# Altium schematic sheet GPS.SchDoc
size A4; SheetNumber: 6; SheetTotal: 8
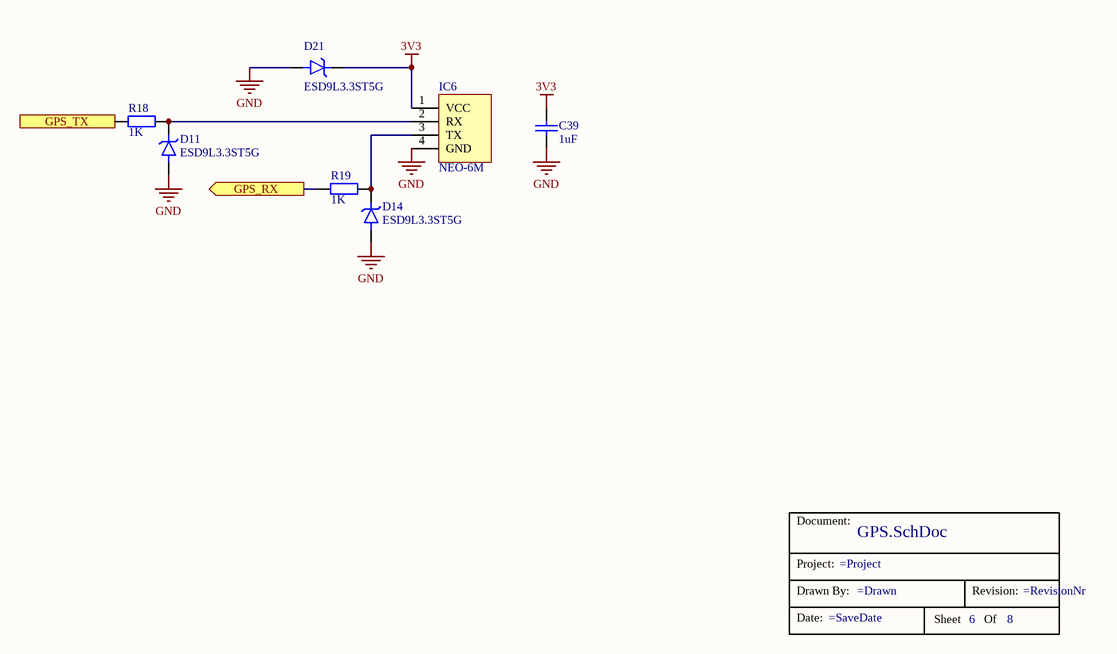
[diagram p0: GPS.SchDoc]

## Parts
*  TitleBox  (value not drawn)
C39  Capacitance: 1uF  [C0603 N]
D11  ESD9L3.3ST5G  [SOD923F, NOMINAL]
D14  ESD9L3.3ST5G  [SOD923F, NOMINAL]
D21  ESD9L3.3ST5G  [SOD923F, NOMINAL]
IC6  NEO-6M  [NEO-6M Module]
R18  1K  [R0603]
R19  1K  [R0603]

## Ports
GPS_RX (out), GPS_TX (in)

## Nets
3V3: C39.2 D21.C IC6.1(VCC)
GND: C39.1 D11.A D14.A D21.A IC6.4(GND)
GPS_RX: R19.2 ; port GPS_RX
GPS_TX: R18.2 ; port GPS_TX
NetD11_C: D11.C IC6.2(RX) R18.1
NetD14_C: D14.C IC6.3(TX) R19.1

## Notes on the sheet
- (in symbol TitleBox) Document:; Project:; Drawn By:; Revision:; Date:; Sheet; Of

## Library data of the parts
C39 = Capacitor: Ceramic capacitor; Type: MLCC; Voltage rating: *V; Characteristic: *; Manufacturer: *; Note: C0603 N
D11 D14 D21 = ESD9L3.3ST5G: TVS DIODE, Unidir, 3.3V/9V, 150mW, SOD-923, ESD9L3.3ST5G, ON SEMICONDUCTOR; Clamping Voltage: 9V; Reverse Standoff Voltage: 3.3V; Breakdown Voltage: 4.8V; Peak Pulse Current: 1A; Leakage Current: 1uA; Supplier 1: Farnell; Manufacturer: ON Semiconductor; Manufacturer Part Number: ESD9L3.3ST5G; Case/Package: SOD-923-2; Operating Temperature Range: -55 .. 125°C; Peak Pulse Power: 150mW; ComponentLink1URL: https://www.verical.com/server-webapp/html/getDatasheet?partID=148186&src-supplier=Verical; ComponentLink1Description: Datasheet; Supplier Part Number 1: 2533269
IC6 = NEO-6M: GPS GLONASS module with antenna, +-2m, -162dBm, 3 .. 5Vin; ComponentLink1Description: Datasheet; ComponentLink1URL: https://www.u-blox.com/sites/default/files/products/documents/NEO-6_DataSheet_(GPS.G6-HW-09005).pdf
R18 R19 = Resistor: Precision: *%; Voltage rating: *V; Temp coefficient: *ppm; Power rating: *mW; Manufacturer: *; Resistance: 1K; Note: R0603